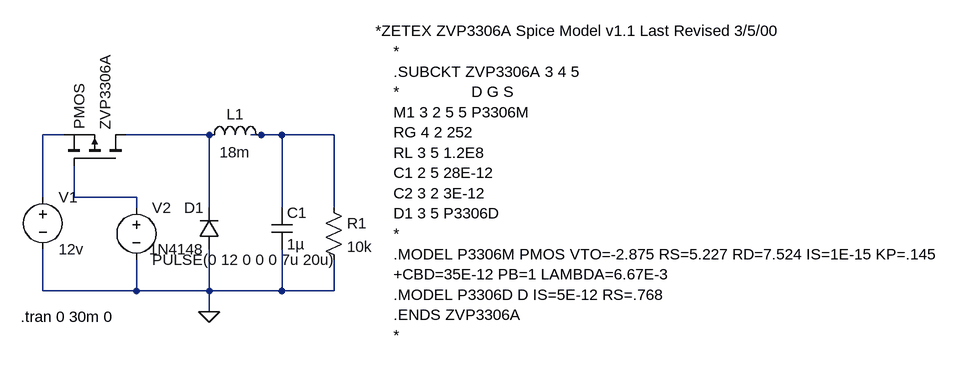
[diagram p0: schematic prelab.asc]
prelab.asc, the LTspice schematic file:
Version 4
SHEET 1 1576 680
WIRE 112 16 80 16
WIRE 336 16 208 16
WIRE 416 16 400 16
WIRE 448 16 416 16
WIRE 528 16 448 16
WIRE 80 112 80 16
WIRE 128 112 128 64
WIRE 224 112 128 112
WIRE 224 128 224 112
WIRE 336 128 336 16
WIRE 448 128 448 16
WIRE 528 128 528 16
WIRE 80 256 80 192
WIRE 224 256 224 208
WIRE 224 256 80 256
WIRE 336 256 336 192
WIRE 336 256 224 256
WIRE 448 256 448 192
WIRE 448 256 336 256
WIRE 528 256 528 208
WIRE 528 256 448 256
WIRE 336 288 336 256
FLAG 336 288 0
SYMBOL voltage 80 96 R0
WINDOW 123 0 0 Left 2
WINDOW 39 0 0 Left 2
SYMATTR InstName V1
SYMATTR Value 12v
SYMBOL voltage 224 112 R0
WINDOW 123 0 0 Left 2
WINDOW 39 0 0 Left 2
SYMATTR InstName V2
SYMATTR Value PULSE(0 12 0 0 0 7u 20u)
SYMBOL pmos 208 64 M270
SYMATTR InstName ZVP3306A
SYMBOL ind 320 32 R270
WINDOW 0 32 56 VTop 2
WINDOW 3 5 56 VBottom 2
SYMATTR InstName L1
SYMATTR Value 18m
SYMBOL diode 352 192 R180
WINDOW 0 24 64 Left 2
WINDOW 3 24 0 Left 2
SYMATTR InstName D1
SYMATTR Value 1N4148
SYMBOL cap 432 128 R0
SYMATTR InstName C1
SYMATTR Value 1µ
SYMBOL res 512 112 R0
SYMATTR InstName R1
SYMATTR Value 10k
TEXT 592 -144 Left 2 !*ZETEX ZVP3306A Spice Model v1.1 Last Revised 3/5/00\n    *\n    .SUBCKT ZVP3306A 3 4 5\n    *                D G S\n    M1 3 2 5 5 P3306M\n    RG 4 2 252\n    RL 3 5 1.2E8\n    C1 2 5 28E-12\n    C2 3 2 3E-12\n    D1 3 5 P3306D\n    *\n    .MODEL P3306M PMOS VTO=-2.875 RS=5.227 RD=7.524 IS=1E-15 KP=.145\n    +CBD=35E-12 PB=1 LAMBDA=6.67E-3\n    .MODEL P3306D D IS=5E-12 RS=.768\n    .ENDS ZVP3306A\n    *
TEXT 46 296 Left 2 !.tran 0 30m 0

The netlist it stands for:
* prelab.asc
V1 N001 0 12v
V2 N004 0 PULSE(0 12 0 0 0 7u 20u)
M§ZVP3306A N002 N004 N001 N001 PMOS
L1 N002 N003 18m
D1 0 N002 1N4148
C1 N003 0 1µ
R1 N003 0 10k
.model D D
.lib standard.dio
.model NMOS NMOS
.model PMOS PMOS
.lib standard.mos
*ZETEX ZVP3306A Spice Model v1.1 Last Revised 3/5/00
    *
    .SUBCKT ZVP3306A 3 4 5
    *                D G S
    M1 3 2 5 5 P3306M
    RG 4 2 252
    RL 3 5 1.2E8
    C1 2 5 28E-12
    C2 3 2 3E-12
    D1 3 5 P3306D
    *
    .MODEL P3306M PMOS VTO=-2.875 RS=5.227 RD=7.524 IS=1E-15 KP=.145
    +CBD=35E-12 PB=1 LAMBDA=6.67E-3
    .MODEL P3306D D IS=5E-12 RS=.768
    .ENDS ZVP3306A
    *
.tran 0 30m 0
.backanno
.end